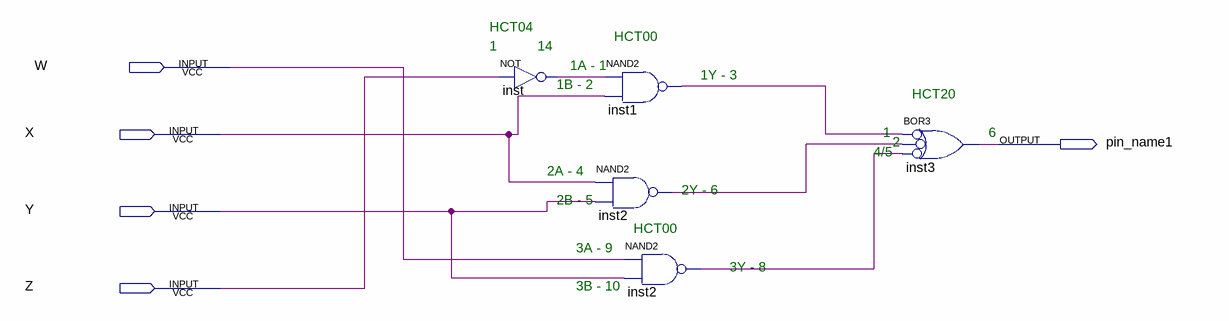
[diagram p0: schematic sheet]
// Quartus schematic Schematic.bdf as structural Verilog: 5 symbols, 5 pins
module Schematic (
  input  W,
  input  X,
  input  Y,
  input  Z,
  output pin_name1
);

  wire inst1_out, inst2_out, inst2_out_2, inst_out;

  not inst (inst_out, Z);
  nand inst1 (inst1_out, inst_out, X);
  nand inst2 (inst2_out, X, Y);
  nand inst2_dup2 (inst2_out_2, W, Y);
  or inst3 (pin_name1, ~inst1_out, ~inst2_out, ~inst2_out_2);  // BOR3

  // Notes on the sheet:
  //   HCT04
  //   HCT00
  //   1
  //   14
  //    1A - 1
  //   1Y - 3
  //   1B - 2
  //   HCT20
  //   1
  //   6
  //   2
  //   4/5
  //   2A - 4
  //   2Y - 6
  //   2B - 5
  //   HCT00
  //   3A - 9
  //   3Y - 8
  //   3B - 10
endmodule
